# EAGLE design shemLamps (EAGLE 9.6.0)
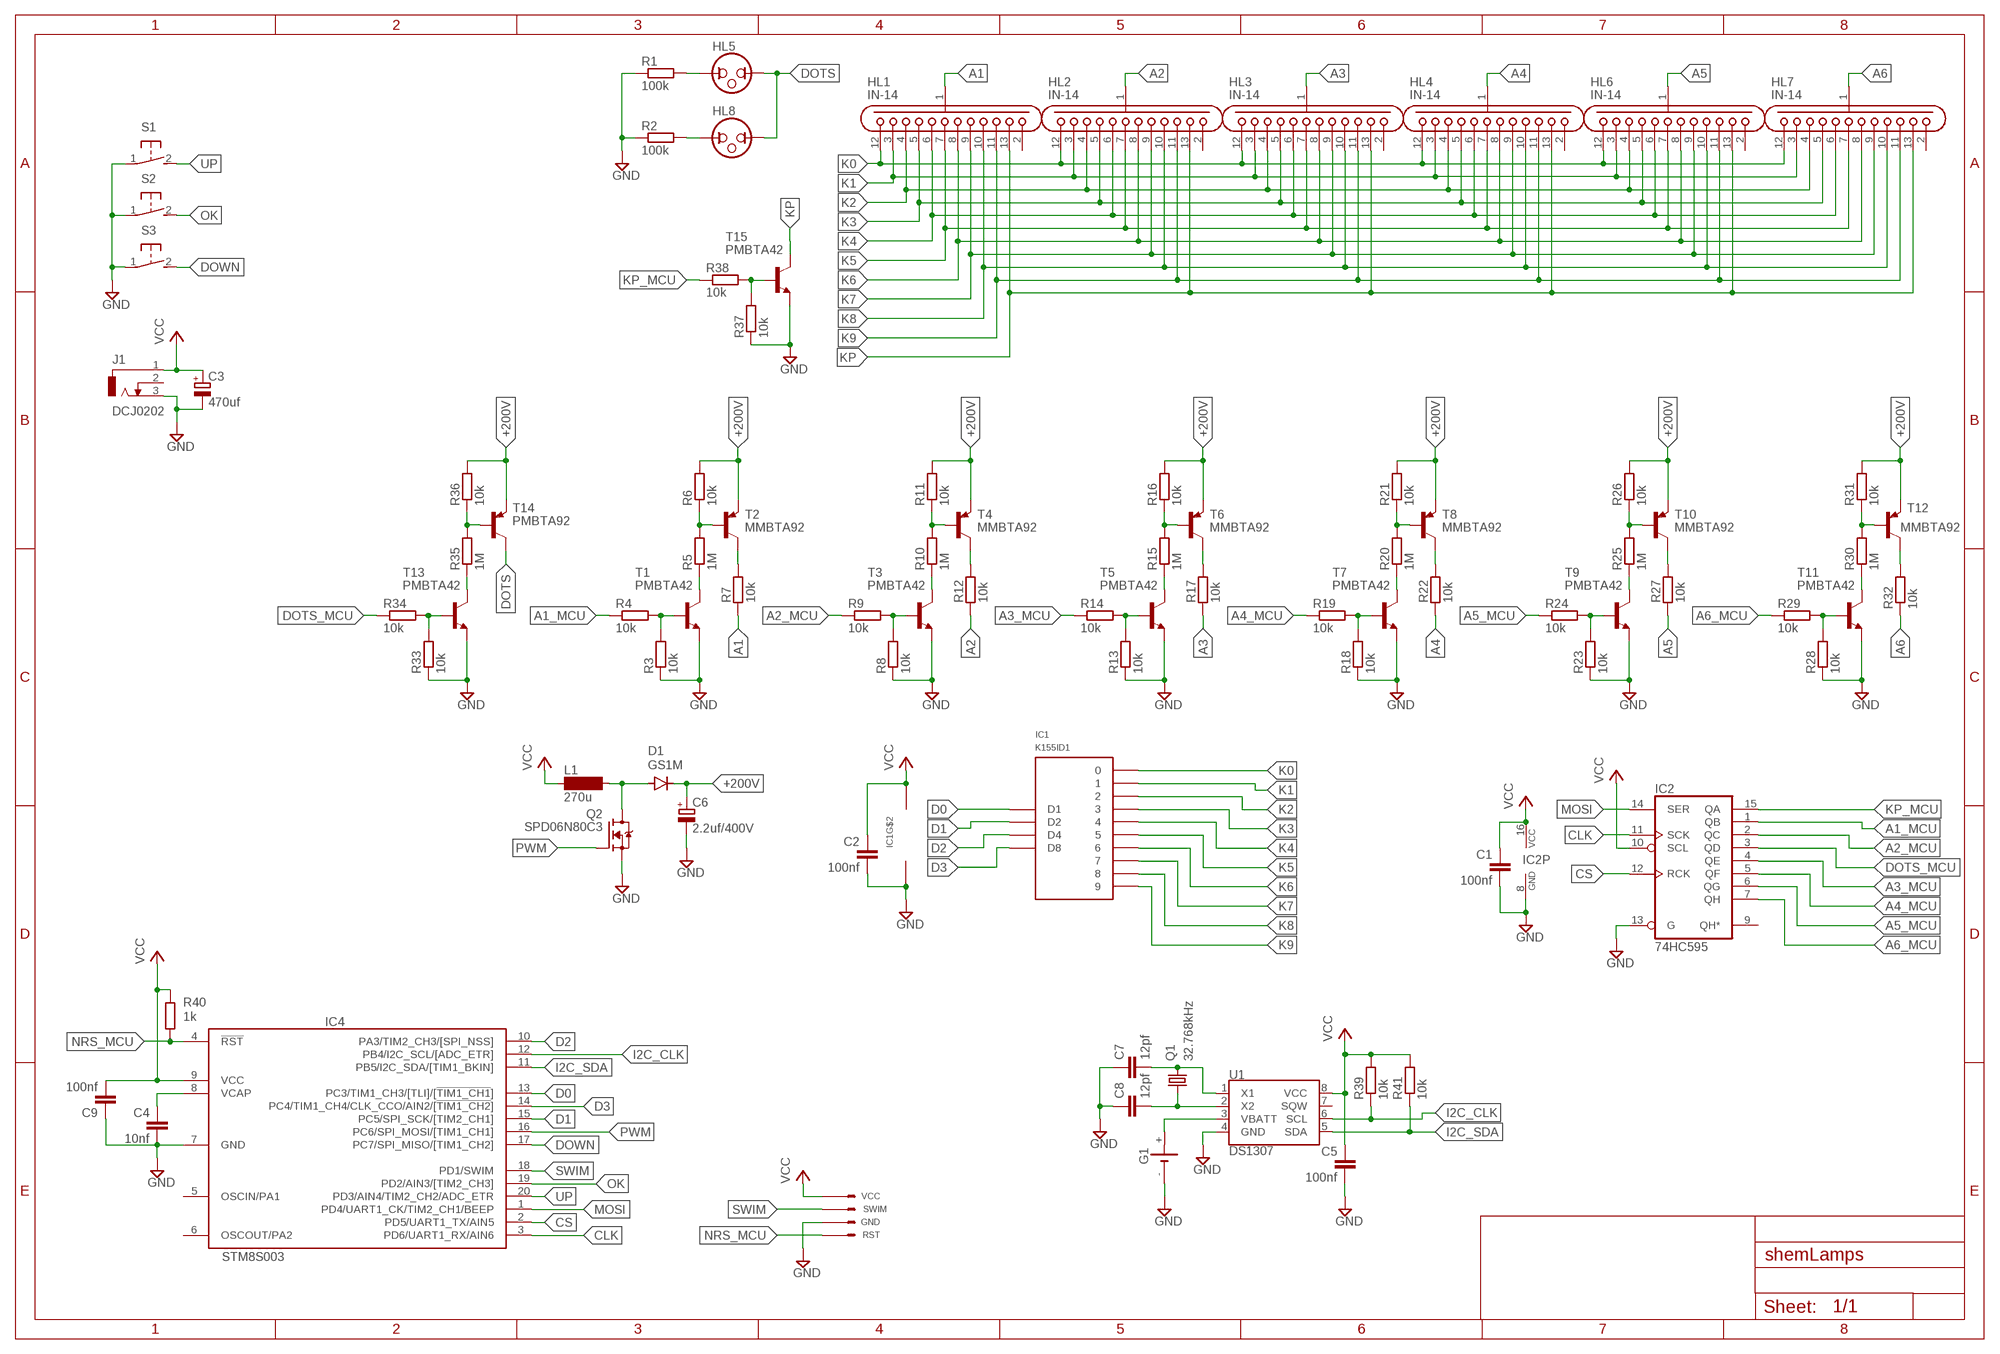
[diagram p0: schematic, sheet 1]

## Parts
C1  100nf  CAP  [C0805]
C2  100nf  CAP  [C0805]
C3  470uf  CPOL-EUE3.5-8  [E3,5-8]
C4  10nf  CAP  [C0805]
C5  100nf  CAP  [C0805]
C6  2.2uf/400V  CPOL-EUE3.5-8  [E3,5-8]
C7  12pf  CAP  [C0805]
C8  12pf  CAP  [C0805]
C9  100nf  CAP  [C0805]
D1  GS1M  DIODE-DO-214AC  [DO-214AC]
G1  BATTERY  [CH291-1220LF_W]
HL1  IN-14  [IN-14]
HL2  IN-14  [IN-14]
HL3  IN-14  [IN-14]
HL4  IN-14  [IN-14]
HL5  NEON_LAMP  [NEON_LAMP]
HL6  IN-14  [IN-14]
HL7  IN-14  [IN-14]
HL8  NEON_LAMP  [NEON_LAMP]
IC1  K155ID1  [DIL16]
IC2  74HC595  [TSSOP16L]
IC4  STM8S003  [TSSOP-20]
J1  DCJ0202  [DCJ0202]
L1  270u  BS11  [BS11]
Q1  32.768kHz  CRYSTALTC26H  [TC26H]
Q2  SPD06N80C3  [TO252]
R1  100k  R-EU_0207/10  [0207/10]
R2  100k  R-EU_0207/10  [0207/10]
R3  10k  RES  [R0805]
R4  10k  RES  [R0805]
R5  1M  RES  [R0805]
R6  10k  RES  [R0805]
R7  10k  RES  [R0805]
R8  10k  RES  [R0805]
R9  10k  RES  [R0805]
R10  1M  RES  [R0805]
R11  10k  RES  [R0805]
R12  10k  RES  [R0805]
R13  10k  RES  [R0805]
R14  10k  RES  [R0805]
R15  1M  RES  [R0805]
R16  10k  RES  [R0805]
R17  10k  RES  [R0805]
R18  10k  RES  [R0805]
R19  10k  RES  [R0805]
R20  1M  RES  [R0805]
R21  10k  RES  [R0805]
R22  10k  RES  [R0805]
R23  10k  RES  [R0805]
R24  10k  RES  [R0805]
R25  1M  RES  [R0805]
R26  10k  RES  [R0805]
R27  10k  RES  [R0805]
R28  10k  RES  [R0805]
R29  10k  RES  [R0805]
R30  1M  RES  [R0805]
R31  10k  RES  [R0805]
R32  10k  RES  [R0805]
R33  10k  RES  [R0805]
R34  10k  RES  [R0805]
R35  1M  RES  [R0805]
R36  10k  RES  [R0805]
R37  10k  RES  [R0805]
R38  10k  RES  [R0805]
R39  10k  RES  [R0805]
R40  1k  RES  [R0805]
R41  10k  RES  [R0805]
S1  31-XX  [B3F-31XX]
S2  31-XX  [B3F-31XX]
S3  31-XX  [B3F-31XX]
SV1  SWIM  [SWIM]
T1  PMBTA42  BC817-16-NPN-SOT23-BEC  [SOT23-BEC]
T2  MMBTA92  BC807-16-PNP-SOT23-BEC  [SOT23-BEC]
T3  PMBTA42  BC817-16-NPN-SOT23-BEC  [SOT23-BEC]
T4  MMBTA92  BC807-16-PNP-SOT23-BEC  [SOT23-BEC]
T5  PMBTA42  BC817-16-NPN-SOT23-BEC  [SOT23-BEC]
T6  MMBTA92  BC807-16-PNP-SOT23-BEC  [SOT23-BEC]
T7  PMBTA42  BC817-16-NPN-SOT23-BEC  [SOT23-BEC]
T8  MMBTA92  BC807-16-PNP-SOT23-BEC  [SOT23-BEC]
T9  PMBTA42  BC817-16-NPN-SOT23-BEC  [SOT23-BEC]
T10  MMBTA92  BC807-16-PNP-SOT23-BEC  [SOT23-BEC]
T11  PMBTA42  BC817-16-NPN-SOT23-BEC  [SOT23-BEC]
T12  MMBTA92  BC807-16-PNP-SOT23-BEC  [SOT23-BEC]
T13  PMBTA42  BC817-16-NPN-SOT23-BEC  [SOT23-BEC]
T14  PMBTA92  BC807-16-PNP-SOT23-BEC  [SOT23-BEC]
T15  PMBTA42  BC817-16-NPN-SOT23-BEC  [SOT23-BEC]
U1  DS1307  [SO08]

## Nets
+200V: C6.+ D1.C R6.2 R11.2 R16.2 R21.2 R26.2 R31.2 R36.2 T2.E T4.E T6.E T8.E T10.E T12.E T14.E
A1: HL1.1(A) R7.1
A1_MCU: IC2.1(QB) R4.1
A2: HL2.1(A) R12.1
A2_MCU: IC2.2(QC) R9.1
A3: HL3.1(A) R17.1
A3_MCU: IC2.4(QE) R14.1
A4: HL4.1(A) R22.1
A4_MCU: IC2.5(QF) R19.1
A5: HL6.1(A) R27.1
A5_MCU: IC2.6(QG) R24.1
A6: HL7.1(A) R32.1
A6_MCU: IC2.7(QH) R29.1
CLK: IC2.11(SCK) IC4.3(PD6/UART1_RX/AIN6)
CS: IC2.12(RCK) IC4.2(PD5/UART1_TX/AIN5)
D0: IC1.3(D1) IC4.13(PC3/TIM1_CH3/[TLI]/[!TIM1_CH1!])
D1: IC1.6(D2) IC4.15(PC5/SPI_SCK/[TIM2_CH1])
D2: IC1.7(D4) IC4.10(PA3/TIM2_CH3/[SPI_NSS])
D3: IC1.4(D8) IC4.14(PC4/TIM1_CH4/CLK_CCO/AIN2/[!TIM1_CH2!])
DOTS: HL5.2 HL8.2 T14.C
DOTS_MCU: IC2.3(QD) R34.1
DOWN: IC4.17(PC7/SPI_MISO/[TIM1_CH2]) S3.2(S)
GND: C1.2 C2.2 C3.- C4.2 C5.2 C6.- C7.1 C8.1 C9.1 G1.- IC1.12(GND) IC2.8(GND) IC2.13(G) IC4.7(GND) J1.3 Q2.2(S) R1.1 R2.1 R3.1 R8.1 R13.1 R18.1 R23.1 R28.1 R33.1 R37.1 S1.1(P) S2.1(P) S3.1(P) SV1.GND T1.E T3.E T5.E T7.E T9.E T11.E T13.E T15.E U1.4(GND)
I2C_CLK: IC4.12(PB4/I2C_SCL/[ADC_ETR]) R39.1 U1.6(SCL)
I2C_SDA: IC4.11(PB5/I2C_SDA/[TIM1_BKIN]) R41.1 U1.5(SDA)
K0: HL1.12(K0) HL2.12(K0) HL3.12(K0) HL4.12(K0) HL6.12(K0) HL7.12(K0) IC1.16
K1: HL1.3(K1) HL2.3(K1) HL3.3(K1) HL4.3(K1) HL6.3(K1) HL7.3(K1) IC1.15
K2: HL1.4(K2) HL2.4(K2) HL3.4(K2) HL4.4(K2) HL6.4(K2) HL7.4(K2) IC1.8
K3: HL1.5(K3) HL2.5(K3) HL3.5(K3) HL4.5(K3) HL6.5(K3) HL7.5(K3) IC1.9
K4: HL1.6(K4) HL2.6(K4) HL3.6(K4) HL4.6(K4) HL6.6(K4) HL7.6(K4) IC1.13
K5: HL1.7(K5) HL2.7(K5) HL3.7(K5) HL4.7(K5) HL6.7(K5) HL7.7(K5) IC1.14
K6: HL1.8(K6) HL2.8(K6) HL3.8(K6) HL4.8(K6) HL6.8(K6) HL7.8(K6) IC1.11
K7: HL1.9(K7) HL2.9(K7) HL3.9(K7) HL4.9(K7) HL6.9(K7) HL7.9(K7) IC1.10
K8: HL1.10(K8) HL2.10(K8) HL3.10(K8) HL4.10(K8) HL6.10(K8) HL7.10(K8) IC1.1
K9: HL1.11(K9) HL2.11(K9) HL3.11(K9) HL4.11(K9) HL6.11(K9) HL7.11(K9) IC1.2
KP: HL1.13(KK) HL2.13(KK) HL3.13(KK) HL4.13(KK) HL6.13(KK) HL7.13(KK) T15.C
KP_MCU: IC2.15(QA) R38.1
MOSI: IC2.14(SER) IC4.1(PD4/UART1_CK/TIM2_CH1/BEEP)
N$1: HL5.1 R1.2
N$2: HL8.1 R2.2
N$3: R3.2 R4.2 T1.B
N$4: R8.2 R9.2 T3.B
N$5: R5.1 T1.C
N$6: R5.2 R6.1 T2.B
N$7: R10.1 T3.C
N$8: R7.2 T2.C
N$9: R10.2 R11.1 T4.B
N$10: R12.2 T4.C
N$11: R13.2 R14.2 T5.B
N$12: R15.1 T5.C
N$13: R15.2 R16.1 T6.B
N$14: R17.2 T6.C
N$15: R18.2 R19.2 T7.B
N$16: R20.1 T7.C
N$17: R20.2 R21.1 T8.B
N$18: R22.2 T8.C
N$19: R23.2 R24.2 T9.B
N$20: R25.1 T9.C
N$21: R25.2 R26.1 T10.B
N$22: R27.2 T10.C
N$23: R28.2 R29.2 T11.B
N$24: R30.1 T11.C
N$25: R30.2 R31.1 T12.B
N$26: R32.2 T12.C
N$27: R37.2 R38.2 T15.B
N$28: D1.A L1.2 Q2.3(D)
N$30: C4.1 IC4.8(VCAP)
N$31: G1.+ U1.3(VBATT)
N$32: C8.2 Q1.2 U1.2(X2)
N$33: R33.2 R34.2 T13.B
N$34: R35.1 T13.C
N$35: R35.2 R36.1 T14.B
N$36: C7.2 Q1.1 U1.1(X1)
NRS_MCU: IC4.4(!RST) R40.1 SV1.NRS(RST)
OK: IC4.19(PD2/AIN3/[TIM2_CH3]) S2.2(S)
PWM: IC4.16(PC6/SPI_MOSI/[TIM1_CH1]) Q2.1(G)
SWIM: IC4.18(PD1/SWIM) SV1.SWIM
UP: IC4.20(PD3/AIN4/TIM2_CH2/ADC_ETR) S1.2(S)
VCC: C1.1 C2.1 C3.+ C5.1 C9.2 IC1.5(VCC) IC2.10(SCL) IC2.16(VCC) IC4.9(VCC) J1.1 L1.1 R39.2 R40.2 R41.2 SV1.VCC U1.8(VCC)
Unconnected: HL1.2(KK2) HL2.2(KK2) HL3.2(KK2) HL4.2(KK2) HL6.2(KK2) HL7.2(KK2) IC2.9(QH*) IC4.5(OSCIN/PA1) IC4.6(OSCOUT/PA2) J1.2 U1.7(SQW)

## Library data of the parts
C1 C2 C4 C5 C7-C9 = myRlc:CAP
C3 C6 = rcl:CPOL-EU: POLARIZED CAPACITOR, European symbol; SPICEPREFIX: C
D1 = diode:DIODE-: DIODE
G1 = clock_7seg_0.8inch:BATTERY
HL1-HL4 HL6 HL7 = LAMPS:IN-14
HL5 HL8 = LAMPS:NEON_LAMP
IC1 = LAMPS:K155ID1
IC2 = inter:74HC595
IC4 = inter:STM8S003: Value line, 16 MHz STM8S 8-bit MCU, 8 Kbytes Flash, 128 bytes data EEPROM, 10-bit ADC, 3 timers, UART, SPI, I2C
J1 = con-jack:DCJ0202: DC POWER JACK Source: DCJ0202.pdf; OC_FARNELL: unknown; OC_NEWARK: unknown
L1 = inductor-neosid:BS: INDUCTOR nominal inductance, magnetically screened; OC_FARNELL: unknown; OC_NEWARK: unknown
Q1 = crystal:CRYSTAL: CRYSTAL; OC_FARNELL: unknown; OC_NEWARK: unknown
Q2 = inter:SPD06N80C3
R1 R2 = rcl:R-EU_: RESISTOR, European symbol; SPICEPREFIX: R
R3-R41 = myRlc:RES
S1-S3 = switch-omron:31-XX: OMRON SWITCH; MPN: B3F-3100; OC_FARNELL: 959704; OC_NEWARK: 36M3582
SV1 = inter:SWIM
T1 T3 T5 T7 T9 T11 T13 T15 = transistor:*-NPN-: NPN Transistror BF959 corrected 2008.03.06
T2 T4 T6 T8 T10 T12 T14 = transistor:*-PNP-: PNP Transistror
U1 = inter:DS1307: Maxim DS1307 - I2C Real-time clock (RTC) The DS1307 serial real-time clock (RTC) is a low-power, full binary-coded decimal (BCD) clock/calendar plus 56 bytes of NV SRAM. Address and data are transferred serially through an I2C, bidirectional bus. The clock/calendar provides seconds, minutes, hours, day, date, month, and year information. SparkFun Products: Real Time Clock Module <https://www.sparkfun.com/products/12708> (BOB-12708) Datasheet <https://cdn.sparkfun.com/datasheets/BreakoutBoards/DS1307.pdf>

## Board
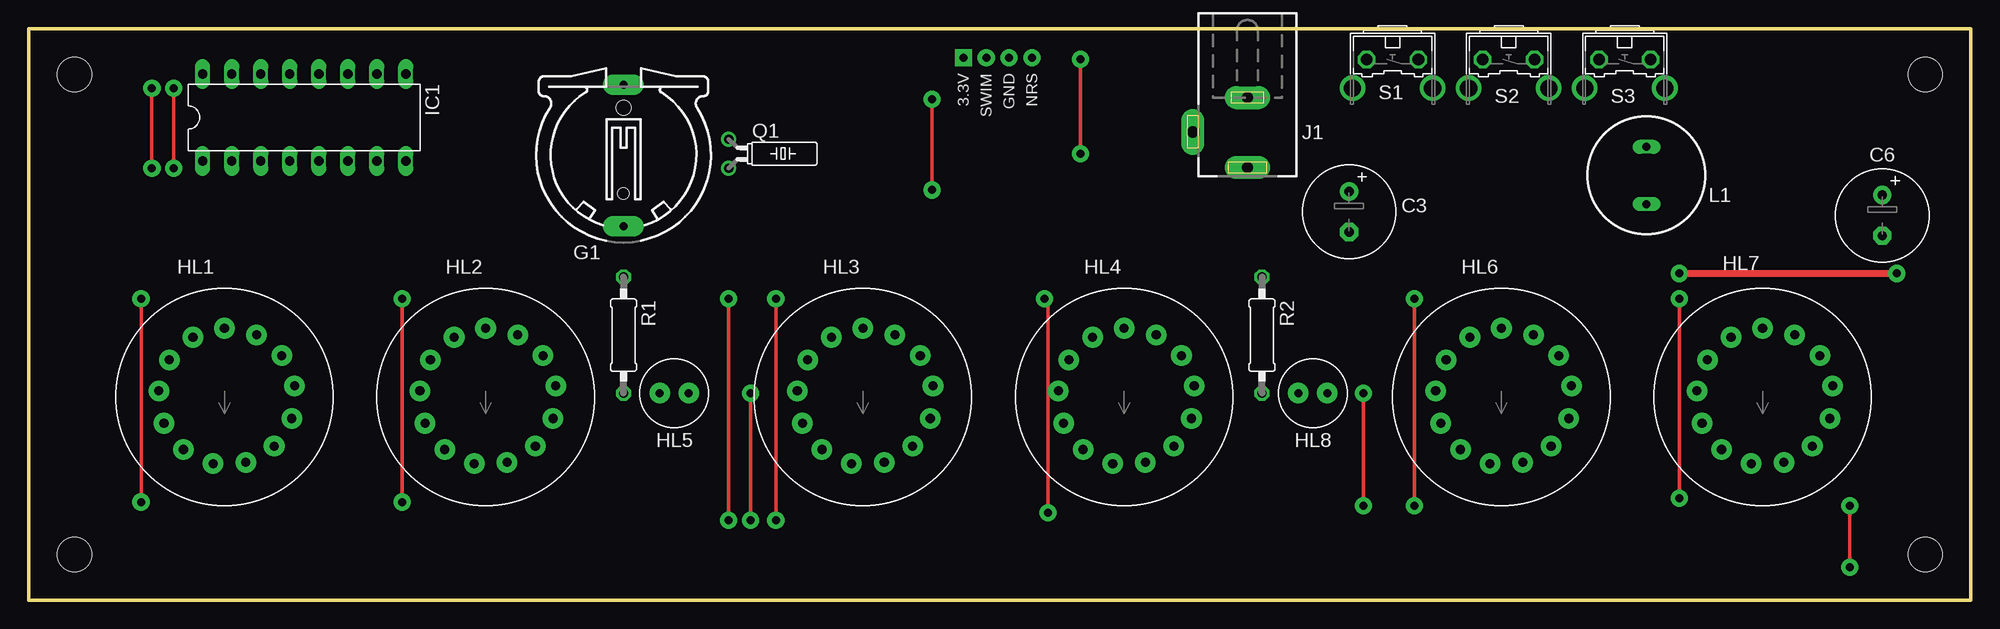
[diagram p1: board, top side]
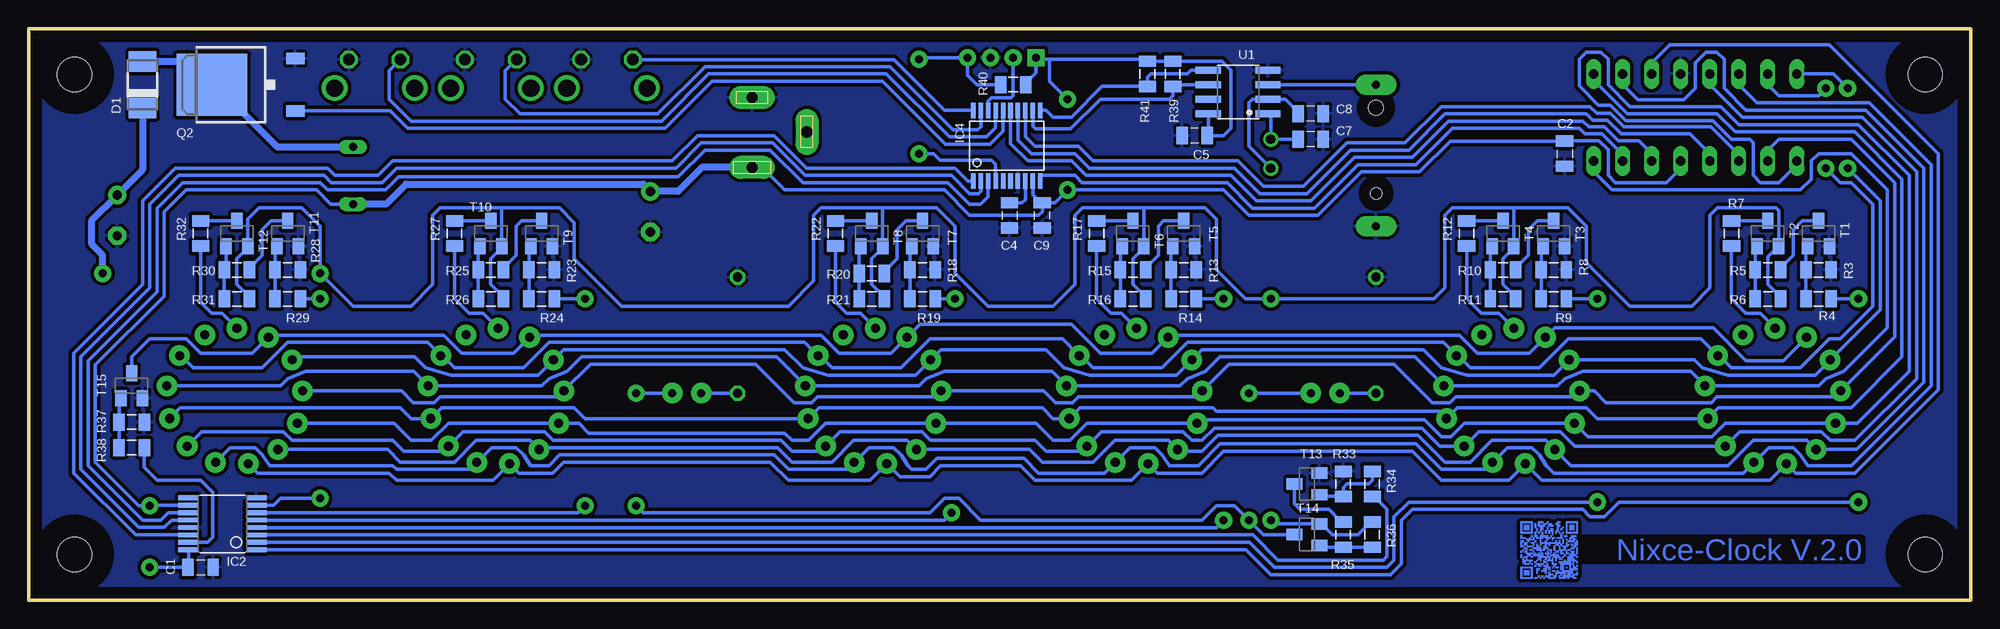
[diagram p2: board, bottom side, seen from below]

Size 170 x 50 mm. Coordinates in mm from the lower left corner, seen from the top.
Outline: 0,0 0,50 170,50 170,0 0,0
Copper layers (1*16): Top 0.035mm / dielectric 1.5mm / Bottom 0.035mm
Design rules "default *": minimum track width 0.3mm, minimum drill 0.7mm, track to track 0.1mm, track to pad 0.1mm, pad to pad 0.1mm, via to via 6mil, smd to smd 6mil, copper to edge 40mil, drill to drill 6mil, minimum pad ring 10mil, minimum via ring 0.4mm, stop-mask expansion 4mil, vias tented up to drill 0mil, thermal gap 10mil
Holes 3 mm at 4,4 4,46 166,4 166,46
bRestrict: area 1,43 to 7,49; area 1,1 to 7,7; area 163,1 to 169,7; area 163,43 to 169,49

### Footprints (pad centres in the part's own frame; a part is rotated, then mirrored left to right if it is on the bottom)
C0805 = smd 1 x 1.5: 1 -1.102,0; 2 1.102,0
E3,5-8 = drill 0.813 pad 1.6: + -1.778,0 | drill 0.813 pad 1.6 octagon: - 1.778,0
DO-214AC = smd 1.8 x 2.4: A 2.025,0; C -2.025,0
CH291-1220LF_W = drill 0.7 pad 1.8 long: + 0,0; - 0,12.383 | hole 1.3: 0,2 | hole 1: 0,9.5
IN-14 = drill 0.8 pad 1.8: 1 0,6; 2 2.806,5.416; 3 5.019,3.595; 4 6.133,0.954; 5 5.892,-1.901; 6 4.351,-4.318; 7 1.864,-5.742; 8 -1,-5.847; 9 -3.585,-4.61; 10 -5.299,-2.313; 11 -5.749,0.518; 12 -4.832,3.233; 13 -2.759,5.212
NEON_LAMP = drill 0.7 pad 1.8: 1 -1.27,0; 2 1.27,0
DIL16 = drill 0.813 long: 1 -8.89,-3.81; 2 -6.35,-3.81; 3 -3.81,-3.81; 4 -1.27,-3.81; 5 1.27,-3.81; 6 3.81,-3.81; 7 6.35,-3.81; 8 8.89,-3.81; 9 8.89,3.81; 10 6.35,3.81; 11 3.81,3.81; 12 1.27,3.81; 13 -1.27,3.81; 14 -3.81,3.81; 15 -6.35,3.81; 16 -8.89,3.81
TSSOP16L = smd 0.42 x 1.78: 1 -2.275,-2.97; 2 -1.625,-2.97; 3 -0.975,-2.97; 4 -0.325,-2.97; 5 0.325,-2.97; 6 0.975,-2.97; 7 1.625,-2.97; 8 2.275,-2.97; 9 2.275,2.97; 10 1.625,2.97; 11 0.975,2.97; 12 0.325,2.97; 13 -0.325,2.97; 14 -0.975,2.97; 15 -1.625,2.97; 16 -2.275,2.97
TSSOP-20 = smd 0.4 x 1.35: 1 -2.54,-3.04; 2 -1.89,-3.04; 3 -1.24,-3.04; 4 -0.59,-3.04; 5 0.06,-3.04; 6 0.71,-3.04; 7 1.36,-3.04; 8 2.01,-3.04; 9 2.66,-3.04; 10 3.31,-3.04; 11 3.31,3.16; 12 2.66,3.16; 13 2.01,3.16; 14 1.36,3.16; 15 0.71,3.16; 16 0.06,3.16; 17 -0.59,3.16; 18 -1.24,3.16; 19 -1.89,3.16; 20 -2.54,3.16
DCJ0202 = drill 1 pad 2 long: 1 0,3.1; 2 4.8,0; 3 0,-3
BS11 = drill 0.7 long: 1 -2.5,0; 2 2.5,0
TC26H = drill 0.813: 1 -1.27,0; 2 1.27,0
TO252 = smd 1 x 1.6: 1 -2.28,-4.8; 2 2.28,-4.8 | smd 5.4 x 6.2: 3 0,2.5
0207/10 = drill 0.813 octagon: 1 -5.08,0; 2 5.08,0
R0805 = smd 1 x 1.5: 1 -1.102,0; 2 1.102,0
B3F-31XX = drill 1.016 octagon: 1 -2.261,-1.245; 2 2.261,-1.245 | drill 1.499 pad 2.159: 3 -3.505,1.245; 4 3.505,1.245
SWIM = drill 0.7 pad 1.5: GND 0.19,0.73; NRS 0.19,2.73; SWIM 0.19,-1.27 | drill 0.7 pad 1.5 square: VCC 0.19,-3.27
SOT23-BEC = smd 1 x 1.4: B -0.95,-1.1; C 0,1.1; E 0.95,-1.1
SO08 = smd 0.61 x 2.21: 1 -1.905,-2.616; 2 -0.635,-2.616; 3 0.635,-2.616; 4 1.905,-2.616; 5 1.905,2.616; 6 0.635,2.616; 7 -0.635,2.616; 8 -1.905,2.616

### Placement (x,y rotation side)
C1  154.94,2.86 0 bottom
C2  35.56,39.05 270 bottom
C3  115.57,33.97 270 top
C4  84.14,33.66 270 bottom
C5  67.94,40.64 180 bottom
C6  162.24,33.66 270 top
C7  57.78,40.32 180 bottom
C8  57.78,42.55 180 bottom
C9  81.28,33.66 90 bottom
D1  160.02,45.09 90 bottom
G1  52.07,45.09 180 top
HL1  17.14,17.78 0 top
HL2  40.01,17.78 0 top
HL3  73.03,17.78 0 top
HL4  95.89,17.78 0 top
HL5  56.52,18.1 0 top
HL6  128.91,17.78 0 top
HL7  151.76,17.78 0 top
HL8  112.39,18.1 0 top
IC1  24.13,42.23 0 top
IC2  153.03,6.67 90 bottom
IC4  84.77,39.69 0 bottom
J1  106.68,40.96 180 top
L1  141.6,37.15 90 top
Q1  61.28,39.05 270 top
Q2  151.45,45.09 90 bottom
R1  52.07,23.18 270 top
R2  107.95,23.18 270 top
R3  13.34,28.89 180 bottom
R4  13.34,26.35 180 bottom
R5  17.78,28.89 180 bottom
R6  17.78,26.35 0 bottom
R7  20.95,32.07 90 bottom
R8  36.51,28.89 180 bottom
R9  36.51,26.35 180 bottom
R10  40.96,28.89 180 bottom
R11  40.96,26.35 0 bottom
R12  44.13,32.07 90 bottom
R13  68.9,28.89 180 bottom
R14  68.9,26.35 180 bottom
R15  73.34,28.89 180 bottom
R16  73.34,26.35 0 bottom
R17  76.52,32.07 90 bottom
R18  91.76,28.89 180 bottom
R19  91.76,26.35 180 bottom
R20  96.2,28.57 180 bottom
R21  96.2,26.35 0 bottom
R22  99.38,32.07 90 bottom
R23  125.09,28.89 180 bottom
R24  125.09,26.35 180 bottom
R25  129.54,28.89 180 bottom
R26  129.54,26.35 0 bottom
R27  132.72,32.07 90 bottom
R28  147.32,28.89 180 bottom
R29  147.32,26.35 180 bottom
R30  151.76,28.89 180 bottom
R31  151.76,26.35 0 bottom
R32  154.94,32.07 90 bottom
R33  54.93,10.16 270 bottom
R34  52.39,10.16 90 bottom
R35  54.93,5.71 270 bottom
R36  52.39,5.71 90 bottom
R37  160.97,15.56 180 bottom
R38  160.97,13.34 180 bottom
R39  69.85,46.04 90 bottom
R40  83.82,45.09 0 bottom
R41  72.07,46.04 90 bottom
S1  119.38,46.04 180 top
S2  129.54,46.04 180 top
S3  139.7,46.04 180 top
SV1  85.09,47.62 270 top
T1  13.34,32.07 0 bottom
T2  17.78,32.07 0 bottom
T3  36.51,32.07 0 bottom
T4  40.96,32.07 0 bottom
T5  68.9,32.07 0 bottom
T6  73.34,32.07 0 bottom
T7  91.76,32.07 0 bottom
T8  96.2,32.07 0 bottom
T9  125.09,32.07 0 bottom
T10  129.54,32.07 0 bottom
T11  147.32,32.07 0 bottom
T12  151.76,32.07 0 bottom
T13  58.1,10.16 90 bottom
T14  58.1,5.71 90 bottom
T15  160.97,18.73 0 bottom
U1  64.14,44.45 90 bottom

### Tracks (layer width: path | path; a pad name or v marks a point on that pad's centre or on a via)
+200V  (via drill 0.7)
  Top 0.3: v61.28,26.35 v61.28,6.99
  Top 0.6: v144.46,28.57 v163.51,28.57
  Bottom 0.3: R6.2 16.68,26.52 17.78,27.62 17.78,30.02 T2.E 16.83,34.05 17.09,34.32 22.2,34.32 22.86,33.66 22.86,27.3 24.45,25.72 29.84,25.72 33.66,29.53 33.66,32.7 35.27,34.32 40.01,34.32 | R11.2 39.85,26.52 40.96,27.62 40.96,29.84 40.01,30.8 T4.E 40.01,34.31 40.01,34.32 | R16.2 72.24,26.52 73.34,27.62 73.34,29.84 72.39,30.8 T6.E 72.39,34.31 72.39,34.32 | R21.2 95.1,26.52 96.2,27.62 96.2,29.84 95.25,30.8 T8.E 95.25,34.32 | 72.39,34.32 77.76,34.32 78.42,33.66 78.42,27.62 80.33,25.72 86.04,25.72 88.9,28.57 88.9,32.7 90.52,34.32 95.25,34.32 | 72.39,34.32 67.02,34.32 66.04,33.34 66.04,28.89 63.5,26.35 v61.28,26.35 46.99,26.35 46.04,27.3 46.04,33.66 45.38,34.32 40.01,34.32 | R26.2 128.44,26.52 129.54,27.62 129.54,29.84 128.59,30.8 T10.E 128.59,34.32 | 128.59,34.32 123.53,34.32 122.24,33.02 122.24,29.84 118.11,25.72 103.5,25.72 101.28,27.94 101.28,33.66 100.62,34.32 95.25,34.32 | R31.2 150.66,26.52 151.76,27.62 151.76,29.84 150.81,30.8 T12.E 150.81,33.34 149.83,34.32 146.08,34.32 144.46,32.7 v144.46,28.57 141.6,25.72 136.53,25.72 134.62,27.62 134.62,33.66 133.96,34.32 128.59,34.32 | R36.2 52.55,6.82 53.66,5.71 55.88,5.71 56.83,6.67 T14.E 60.96,6.67 v61.28,6.99
  Bottom 0.6: v163.51,28.57 163.51,30.16 164.47,31.11 164.47,33.21 C6.+ 160.02,37.66 D1.C
A1
  Bottom 0.3: HL1.1 18.45,25.08 19.68,25.08 20.95,26.35 R7.1
A1_MCU  (via drill 0.7)
  Top 0.3: v9.84,26.35 v9.84,8.57
  Bottom 0.3: R4.1 v9.84,26.35 | IC2.1 63.45,4.39 61.28,2.22 50.8,2.22 49.85,3.17 49.85,6.99 48.9,7.94 33.97,7.94 33.34,7.3 32.07,7.3 30.8,8.57 v9.84,8.57
A2
  Bottom 0.3: HL2.1 41.31,25.08 42.86,25.08 44.13,26.35 R12.1
A2_MCU  (via drill 0.7)
  Top 0.3: v32.7,26.35 v32.7,8.57
  Bottom 0.3: R9.1 v32.7,26.35 | v32.7,8.57 49.21,8.57 50.48,7.3 50.48,3.49 51.12,2.86 60.96,2.86 63.15,5.04 IC2.2
A3
  Bottom 0.3: HL3.1 74.33,25.08 75.25,25.08 76.52,26.35 R17.1
A3_MCU  (via drill 0.7)
  Top 0.3: v65.41,26.35 v65.41,6.99
  Bottom 0.3: R14.1 v65.41,26.35 | IC2.4 66.05,6.34 v65.41,6.99
A4
  Bottom 0.3: HL4.1 97.19,25.08 98.42,25.08 99.38,26.04 R22.1
A4_MCU  (via drill 0.7)
  Top 0.3: v88.9,26.35 89.22,26.04 v89.22,7.62
  Bottom 0.3: R19.1 v88.9,26.35 | IC2.5 89.84,6.99 v89.22,7.62
A5
  Bottom 0.3: HL6.1 130.21,25.08 131.44,25.08 132.72,26.35 R27.1
A5_MCU  (via drill 0.7)
  Top 0.3: v121.28,26.35 v121.28,8.26
  Bottom 0.3: R24.1 v121.28,26.35 | IC2.6 121.9,7.64 v121.28,8.26
A6
  Bottom 0.3: HL7.1 153.07,25.08 153.99,25.08 154.94,26.04 R32.1
A6_MCU  (via drill 0.7)
  Top 0.3: v144.46,26.35 v144.46,8.89
  Bottom 0.3: R29.1 v144.46,26.35 | IC2.7 148.55,8.29 147.96,8.89 v144.46,8.89
CLK
  Bottom 0.3: IC2.11 157.78,7.64 158.43,6.99 160.02,6.99 164.78,11.75 164.78,20.95 158.75,26.99 158.75,34.29 156.53,36.51 144.46,36.51 143.83,35.88 138.75,35.88 137.59,37.03 113.14,37.03 110.81,39.37 105.09,39.37 102.23,36.51 89.53,36.51 87.63,34.61 86.68,34.61 86.01,35.27 IC4.3
CS
  Bottom 0.3: IC2.12 157.47,6.99 158.12,6.35 160.34,6.35 165.42,11.43 165.42,21.27 159.38,27.3 159.38,34.61 156.84,37.15 144.15,37.15 143.51,36.51 139.06,36.51 137.79,37.78 113.35,37.78 111.12,40.01 104.89,40.01 102.04,37.15 89.22,37.15 87.63,35.56 86.87,35.56 86.66,35.77 IC4.2
D0
  Bottom 0.3: IC1.3 20.32,38.95 22.76,41.39 30.37,41.39 31.57,42.59 32.75,42.59 33.34,43.18 46.35,43.18 49.53,40.01 54.61,40.01 58.42,36.2 61.91,36.2 64.14,38.42 76.83,38.42 78.11,39.69 81.92,39.69 82.76,40.53 IC4.13
D1
  Bottom 0.3: IC1.6 27.94,39.05 29.08,40.19 30.86,40.19 32.06,41.39 33.45,41.39 33.97,41.91 45.72,41.91 48.9,38.73 53.98,38.73 57.78,34.92 62.55,34.92 64.77,37.15 77.47,37.15 78.74,38.42 82.55,38.42 84.06,39.93 IC4.15
D2
  Bottom 0.3: IC1.7 30.48,38.96 32.31,40.79 33.8,40.79 34.29,41.27 45.4,41.27 48.58,38.1 53.66,38.1 57.47,34.29 62.87,34.29 65.09,36.51 77.79,36.51 78.42,37.15 81.46,37.15 IC4.10
D3
  Bottom 0.3: IC1.4 22.86,39.05 24.6,40.79 30.61,40.79 31.81,41.99 33.1,41.99 33.66,42.55 46.04,42.55 49.21,39.37 54.29,39.37 58.1,35.56 62.23,35.56 64.45,37.78 77.15,37.78 78.42,39.05 82.23,39.05 83.41,40.23 IC4.14
DOTS  (via drill 0.7)
  Top 0.3: v116.84,8.26 v116.84,18.1 | v63.18,18.1 v63.18,6.99
  Bottom 0.3: v116.84,18.1 HL8.2 | T14.C 61.91,5.71 v63.18,6.99 64.45,8.26 66.04,8.26 67.31,6.99 86.68,6.99 88.58,8.89 89.85,8.89 91.12,7.62 116.2,7.62 v116.84,8.26 | HL5.2 v63.18,18.1
DOTS_MCU
  Bottom 0.3: R34.1 52.24,9.06 51.12,7.94 51.12,3.81 51.44,3.49 60.64,3.49 62.84,5.69 IC2.3
DOWN
  Bottom 0.3: IC4.17 85.36,41.32 86.17,40.51 89.41,40.51 94.93,46.04 110.49,46.04 114.62,41.91 136.53,41.91 138.43,43.81 138.43,46.29 S3.2
GND
  pour Bottom (isolate 0.3): 0,0 170,0 170,50 0,50
I2C_CLK
  Bottom 0.3: IC4.12 82.11,41.47 81.86,41.22 78.79,41.22 76.2,43.81 70.17,43.81 69.85,44.13 R39.1 69.7,45.09 U1.6
I2C_SDA
  Bottom 0.3: U1.5 68.26,46.35 68.58,46.04 71.75,46.04 72.07,45.72 R41.1 76.03,44.94 78.74,42.23 80.33,42.23 80.95,42.85 IC4.11
K0  (via drill 0.7)
  Top 0.3: v10.79,37.78 v10.79,44.77
  Bottom 0.3: v10.79,44.77 12.06,46.04 IC1.16 | v10.79,37.78 7.94,34.92 7.94,25.39 HL1.12 13.64,19.68 21.27,19.68 23.5,20.32 24.19,21.01 HL2.12 36.5,19.68 44.13,19.68 46.35,20.32 47.94,21.91 67.3,21.91 HL3.12 69.52,19.68 77.15,19.68 79.38,20.32 80.96,21.91 90.16,21.91 HL4.12 92.38,19.68 100.01,19.68 102.23,20.32 103.82,21.91 123.18,21.91 HL6.12 125.4,19.68 133.03,19.68 135.25,20.32 136.21,21.27 146.67,21.27 HL7.12
K1  (via drill 0.7)
  Top 0.3: v12.7,44.77 v12.7,37.78
  Bottom 0.3: v12.7,44.77 13.34,44.13 16.83,44.13 17.78,45.09 IC1.15 | v12.7,37.78 11.43,36.51 10.48,36.51 8.57,34.61 8.57,25.72 11.43,22.86 12.38,22.86 14.92,20.32 20.95,20.32 22.01,21.38 HL1.3 23.65,22.86 35.24,22.86 37.78,20.32 43.81,20.32 44.87,21.38 HL2.3 46.19,22.54 68.58,22.54 70.8,20.32 76.83,20.32 77.89,21.38 HL3.3 79.53,22.86 91.12,22.86 93.66,20.32 99.69,20.32 100.75,21.38 HL4.3 102.07,22.54 124.46,22.54 126.68,20.32 132.72,20.32 133.77,21.38 HL6.3 135.09,22.54 147.32,22.54 149.54,20.32 155.57,20.32 156.63,21.38 HL7.3
K2
  Bottom 0.3: IC1.8 33.02,37.47 31.43,35.88 14.92,35.88 13.97,36.83 13.97,38.42 13.34,39.05 10.48,39.05 7.3,35.88 7.3,23.81 11.11,20 12.7,19.37 13.33,18.73 HL1.4 23.28,18.77 24.51,20 33.97,20 35.56,19.37 36.19,18.73 HL2.4 48.68,21.27 65.72,21.27 66.99,20 68.58,19.37 69.21,18.73 HL3.4 80.43,20 89.85,20 91.44,19.37 92.07,18.73 HL4.4 104.56,21.27 121.6,21.27 122.87,20 124.46,19.37 125.09,18.73 HL6.4 136.31,20 145.73,20 147.32,19.37 147.95,18.73 HL7.4
K3
  Bottom 0.3: IC1.9 33.02,45.5 30.07,42.55 22.23,42.55 20.64,40.96 10.16,40.96 6.03,36.83 6.03,21.27 10.48,16.83 22.09,16.83 HL1.5 32.71,15.88 33.66,16.83 44.95,16.83 HL2.5 46.53,16.51 66.04,16.51 66.36,16.83 77.97,16.83 HL3.5 80.33,15.88 81.28,16.83 100.83,16.83 HL4.5 121.29,15.88 122.24,16.83 133.85,16.83 HL6.5 136.53,15.88 137.48,16.83 156.71,16.83 HL7.5
K4
  Bottom 0.3: IC1.13 22.86,45.09 20,42.23 9.53,42.23 4.76,37.47 4.76,19.37 10.16,13.97 12.32,13.97 13.08,14.73 20.23,14.73 HL1.6 34.67,13.46 35.94,14.73 43.09,14.73 HL2.6 46.48,13.46 48.07,15.05 66.23,15.05 67.31,13.97 68.2,13.97 68.96,14.73 76.11,14.73 HL3.6 77.82,13.02 80.96,13.02 81.92,13.97 91.06,13.97 91.82,14.73 98.97,14.73 HL4.6 100.68,13.02 103.19,13.02 104.14,13.97 124.08,13.97 124.84,14.73 131.99,14.73 HL6.6 133.7,13.02 137.16,13.02 138.11,13.97 146.94,13.97 147.7,14.73 154.85,14.73 HL7.6
K5
  Bottom 0.3: IC1.14 20.32,45.09 18.73,43.5 8.89,43.5 3.49,38.1 3.49,18.73 10.48,11.75 14.29,11.75 14.92,12.7 15.56,13.34 17.71,13.34 HL1.7 19.93,11.11 36.51,11.11 37.15,11.75 37.78,12.7 38.42,13.34 40.57,13.34 HL2.7 42.48,11.43 46.35,11.43 48.58,13.65 65.72,13.65 67.63,11.75 70.17,11.75 70.8,12.7 71.44,13.34 73.59,13.34 HL3.7 75.81,11.11 81.6,11.11 82.87,12.38 90.49,12.38 91.44,11.43 92.71,11.43 93.03,11.75 93.66,12.7 94.3,13.34 96.45,13.34 HL4.7 98.36,11.43 103.5,11.43 104.78,12.7 123.51,12.7 124.46,11.75 126.05,11.75 126.68,12.7 127.32,13.34 129.47,13.34 HL6.7 131.38,11.43 137.79,11.43 138.11,11.75 148.91,11.75 149.54,12.7 150.18,13.34 152.33,13.34 HL7.7
K6
  Bottom 0.3: IC1.11 27.94,46.99 26.35,48.58 12.38,48.58 2.86,39.05 2.86,18.41 10.16,11.11 15.32,11.11 HL1.8 17.6,10.48 37.55,10.48 HL2.8 40.46,10.48 46.35,10.48 48.9,13.02 65.41,13.02 67.31,11.11 71.2,11.11 HL3.8 73.48,10.48 81.92,10.48 83.19,11.75 90.17,11.75 91.12,10.79 93.75,10.79 HL4.8 96.34,10.48 103.5,10.48 105.09,12.06 123.19,12.06 124.14,11.11 127.08,11.11 HL6.8 129.36,10.48 137.79,10.48 138.43,11.11 149.94,11.11 HL7.8
K7
  Bottom 0.3: IC1.10 30.48,45.09 29.15,43.75 25.15,43.75 24.13,44.77 24.13,46.99 23.97,47.15 23.97,47.16 23.19,47.94 22.23,47.94 21.59,47.31 21.59,44.77 19.68,42.86 9.21,42.86 4.13,37.78 4.13,19.05 10.01,13.17 HL1.9 14.36,13.97 19.05,13.97 21.27,11.75 35,11.75 HL2.9 37.22,13.97 41.91,13.97 43.81,12.06 46.04,12.06 48.39,14.41 65.91,14.41 67.31,13.02 69.29,13.02 HL3.9 70.24,13.97 74.93,13.97 76.83,12.06 81.28,12.06 82.39,13.17 HL4.9 93.1,13.97 97.79,13.97 99.69,12.06 103.19,12.06 104.46,13.34 125.16,13.34 HL6.9 126.12,13.97 130.81,13.97 132.72,12.06 137.48,12.06 138.58,13.17 HL7.9
K8
  Bottom 0.3: IC1.1 15.24,38.1 16.83,36.51 18.41,36.51 19.05,37.15 19.05,40.01 19.37,40.32 20.95,40.32 22.58,41.95 30.2,41.95 31.54,43.29 32.6,43.29 34.29,44.98 34.29,47.31 33.66,47.94 32.38,47.94 31.75,47.31 31.75,45.08 29.85,43.18 21.91,43.18 20.32,41.59 9.84,41.59 5.4,37.15 5.4,20 9.93,15.47 HL1.10 21.49,15.47 22.67,14.29 33.53,14.29 HL2.10 44.35,15.47 45.53,14.29 46.35,14.29 47.85,15.79 67.41,15.79 HL3.10 77.37,15.47 78.87,13.97 80.33,13.97 81.83,15.47 HL4.10 100.23,15.47 101.73,13.97 103.19,13.97 103.82,14.61 120.97,14.61 121.83,15.47 HL6.10 133.25,15.47 134.75,13.97 136.53,13.97 138.02,15.47 HL7.10
K9
  Bottom 0.3: IC1.2 17.78,39.37 16.83,40.32 10.48,40.32 6.67,36.51 6.67,23.03 HL1.11 11.91,17.78 22.23,17.78 22.73,17.27 31.94,17.27 32.97,18.3 HL2.11 34.77,17.78 45.09,17.78 45.59,17.27 47.12,17.27 50.48,20.64 64.94,20.64 HL3.11 67.79,17.78 78.11,17.78 78.61,17.27 80.14,17.27 81.16,18.3 HL4.11 90.65,17.78 100.97,17.78 101.47,17.27 103,17.27 106.36,20.64 120.82,20.64 HL6.11 123.67,17.78 133.99,17.78 134.49,17.27 136.33,17.27 137.36,18.3 HL7.11
KP
  Bottom 0.3: HL1.13 16.42,20.95 19.68,20.95 22.54,23.81 36.43,23.81 HL2.13 38.65,21.59 43.18,21.59 44.77,23.18 70.08,23.18 HL3.13 71.67,21.59 76.2,21.59 78.74,24.13 91.99,24.13 HL4.13 94.53,21.59 99.06,21.59 100.65,23.18 125.96,23.18 HL6.13 127.55,21.59 132.08,21.59 133.67,23.18 148.82,23.18 HL7.13 150.41,21.59 154.94,21.59 156.21,22.86 159.38,22.86 160.97,21.27 T15.C
KP_MCU
  Bottom 0.3: IC2.15 154.34,5.04 153.91,5.48 153.91,9.44 154.94,10.48 158.75,10.48 159.87,11.6 R38.1
MOSI
  Bottom 0.3: IC2.14 160.63,5.69 166.05,11.11 166.05,21.59 160.02,27.62 160.02,34.92 157.16,37.78 143.83,37.78 143.19,37.15 139.38,37.15 138.11,38.42 113.67,38.42 111.44,40.64 104.78,40.64 101.92,37.78 88.9,37.78 87.77,36.65 IC4.1
N$1
  Bottom 0.3: HL5.1 R1.2
N$2
  Bottom 0.3: R2.2 HL8.1
N$3
  Bottom 0.3: R4.2 R3.2 14.44,30.82 T1.B
N$4
  Bottom 0.3: R9.2 R8.2 37.62,30.82 T3.B
N$5
  Bottom 0.3: R5.1 16.68,29.04 15.56,30.16 15.56,32.38 14.78,33.17 T1.C
N$6
  Bottom 0.3: T2.B 18.88,30.82 R5.2 R6.1
N$7
  Bottom 0.3: R10.1 39.85,29.04 38.73,30.16 38.73,32.38 37.95,33.17 T3.C
N$8
  Bottom 0.3: R7.2 T2.C
N$9
  Bottom 0.3: R11.1 R10.2 42.06,30.82 T4.B
N$10
  Bottom 0.3: R12.2 T4.C
N$11
  Bottom 0.3: R14.2 R13.2 70,30.97 T5.B
N$12
  Bottom 0.3: R15.1 72.24,29.04 71.12,30.16 71.12,32.7 70.66,33.17 T5.C
N$13
  Bottom 0.3: R16.1 R15.2 74.44,30.97 T6.B
N$14
  Bottom 0.3: R17.2 T6.C
N$15
  Bottom 0.3: R19.2 R18.2 92.86,30.97 T7.B
N$16
  Bottom 0.3: R20.1 95.1,28.73 93.98,29.84 93.98,32.38 93.2,33.17 T7.C
N$17
  Bottom 0.3: R21.1 R20.2 97.31,30.97 T8.B
N$18
  Bottom 0.3: R22.2 T8.C
N$19
  Bottom 0.3: R24.2 R23.2 126.2,30.82 T9.B
N$20
  Bottom 0.3: R25.1 128.44,29.04 127.32,30.16 127.32,32.7 126.85,33.17 T9.C
N$21
  Bottom 0.3: R26.1 R25.2 130.64,30.82 T10.B
N$22
  Bottom 0.3: R27.2 T10.C
N$23
  Bottom 0.3: R29.2 R28.2 148.42,30.82 T11.B
N$24
  Bottom 0.3: R30.1 150.66,29.04 149.54,30.16 149.54,32.38 148.76,33.17 T11.C
N$25
  Bottom 0.3: R31.1 R30.2 152.72,29.05 T12.B
N$26
  Bottom 0.3: R32.2 T12.C
N$27
  Bottom 0.3: R38.2 R37.2 162.07,17.48 T15.B
N$28
  Bottom 0.6: L1.2 148.23,39.65 153.67,45.09 Q2.3 155.97,47.11 D1.A
N$30
  Bottom 0.3: IC4.8 82.76,35.03 83.03,34.76 C4.1
N$31
  Bottom 0.3: G1.+ U1.3
N$32
  Bottom 0.3: Q1.2 63.18,39.69 63.18,43.5 62.87,43.81 U1.2 60.01,43.81 58.89,42.7 C8.2
N$33
  Bottom 0.3: T13.B 56.85,9.06 R33.2 54.93,9.84 54.61,10.16 52.7,10.16 52.39,10.48 R34.2
N$34
  Bottom 0.3: R35.1 55.08,6.82 56.2,7.94 58.74,7.94 59.2,8.4 T13.C
N$35
  Bottom 0.3: R36.1 R35.2 56.85,4.61 T14.B
N$36
  Bottom 0.3: U1.1 61.28,42.3 Q1.1 C7.2
NRS_MCU  (via drill 0.7)
  Top 0.3: v92.08,47.31 v92.08,39.05
  Bottom 0.3: v92.08,47.31 91.95,47.44 SV1.NRS 87.82,45.91 87,45.09 R40.1 | IC4.4 85.36,38.12 85.72,38.48 90.23,38.48 90.81,39.05 v92.08,39.05
OK
  Bottom 0.3: IC4.19 86.66,41.42 86.93,41.15 89.09,41.15 94.61,46.67 110.81,46.67 114.94,42.55 127,42.55 128.27,43.81 128.27,46.29 S2.2
PWM
  Bottom 0.3: IC4.16 84.71,41.02 85.85,39.88 89.72,39.88 95.25,45.4 105.07,45.4 105.08,45.41 110.17,45.41 114.3,41.27 136.84,41.27 138.37,42.8 Q2.1
SWIM
  Bottom 0.3: IC4.18 86.01,43.65 85.72,43.94 84.01,43.94 83.82,44.13 SV1.SWIM
UP
  Bottom 0.3: S1.2 94.27,47.28 89.84,42.85 IC4.20
VCC  (via drill 0.7)
  Top 0.3: v159.38,8.26 v159.38,2.86 | v79.06,35.88 v79.06,43.81
  Bottom 0.3: IC2.10 159.35,8.29 v159.38,8.26 160.34,8.26 164.15,12.06 164.15,20.57 158.12,26.6 158.12,33.97 156.21,35.88 144.78,35.88 143.55,34.65 L1.1 | IC1.5 25.4,37.78 26.67,36.51 31.11,36.51 31.75,37.15 31.75,39.38 32.56,40.19 35.53,40.19 C2.1 45.57,40.16 48.26,37.47 53.34,37.47 57.15,33.66 63.18,33.66 65.41,35.88 v79.06,35.88 80.18,34.76 C9.2 | R40.2 82.72,45.23 81.82,46.13 SV1.VCC 81.69,47.31 80.64,47.31 | J1.1 105.8,37.86 103.82,35.88 89.85,35.88 87.63,33.66 81.6,33.66 81.28,33.97 C9.2 | U1.8 66.75,40.73 C5.1 65.41,40.64 64.77,41.27 64.77,46.35 65.56,47.14 R39.2 R41.2 72.24,47.31 80.64,47.31 | v79.06,43.81 80.64,45.4 80.64,47.31 | C9.2 81.43,34.76 82.11,35.44 IC4.9 | IC2.16 156,2.9 C1.1 v159.38,2.86
  Bottom 0.6: J1.1 111.05,37.86 113.16,35.75 C3.+ 116.2,36.39 136.97,36.39 138.71,34.65 L1.1
(copper drawn outside any net)
  shapes: Bottom area x843

### Text on the board
Bottom: Nixce-Clock V.2.0